# Altium schematic sheet I2S_DAC.SchDoc
size A4
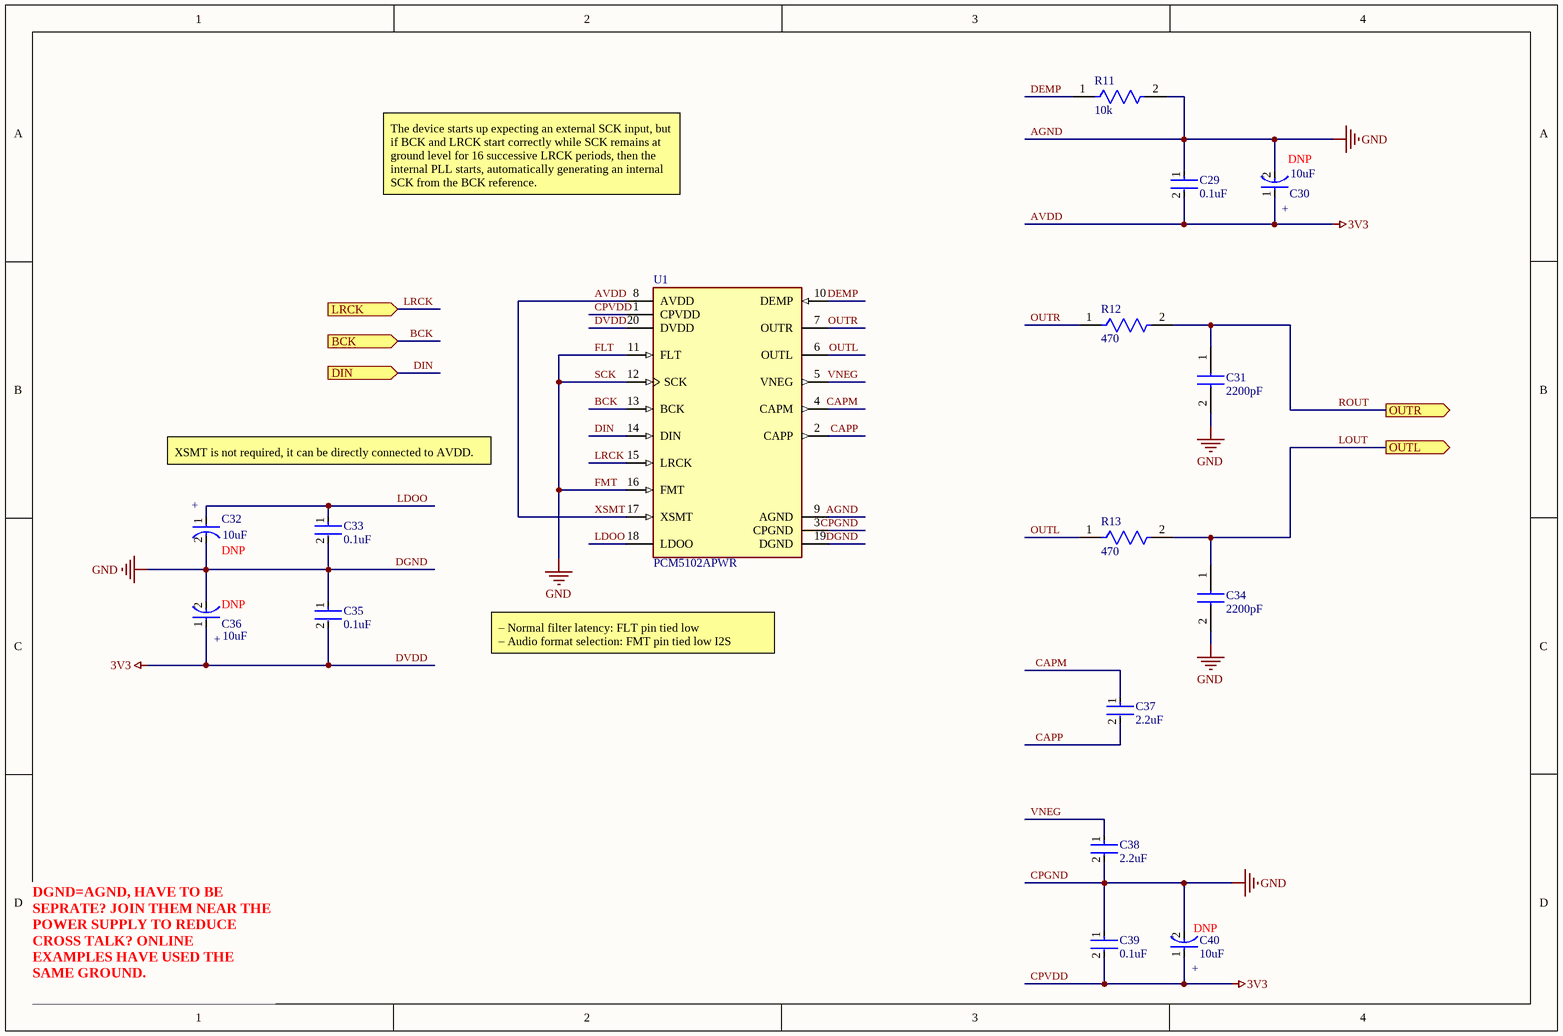
[diagram p0: I2S_DAC.SchDoc]

## Parts
C29  0.1uF  [TDK_C2012-125-0_2_IPC_A]
C30  10uF  Load: DNP  [Panasonic_EEE-1CA100SR_0]
C31  2200pF  [CAPC1608X90N]
C32  10uF  Load: DNP  [Panasonic_EEE-1CA100SR_0]
C33  0.1uF  [TDK_C2012-125-0_2_IPC_A]
C34  2200pF  [CAPC1608X90N]
C35  0.1uF  [TDK_C2012-125-0_2_IPC_A]
C36  10uF  Load: DNP  [Panasonic_EEE-1CA100SR_0]
C37  2.2uF  [Samsung_CL21_IPC_A]
C38  2.2uF  [Samsung_CL21_IPC_A]
C39  0.1uF  [TDK_C2012-125-0_2_IPC_A]
C40  10uF  Load: DNP  [Panasonic_EEE-1CA100SR_0]
R11  10k  [Stackpole_Electronics_RMCF0603_IPC_A]
R12  470  [Stackpole_Electronics_RMCF0603_IPC_A]
R13  470  [Stackpole_Electronics_RMCF0603_IPC_A]
U1  PCM5102APWR  [Texas_Instruments_PW0020A_IPC_A]

## Ports
BCK (in), DIN (in), LRCK (in), OUTL (out), OUTR (out)

## Nets
AGND: C29.1 C30.2(C) C31.2 C32.2(C) C33.2 C34.2 C35.1 C36.2(C) C38.2 C39.1 C40.2(C) R11.2 U1.3(CPGND) U1.9(AGND) U1.11(FLT) U1.12(SCK) U1.16(FMT) U1.19(DGND)  [also labelled CPGND, DGND, FLT, FMT, GND, SCK]
AVDD: C29.2 C30.1(A) C35.2 C36.1(A) C39.2 C40.1(A) U1.1(CPVDD) U1.8(AVDD) U1.17(XSMT) U1.20(DVDD)  [also labelled 3V3, CPVDD, DVDD, XSMT]
BCK: U1.13(BCK) ; port BCK
CAPM: C37.1 U1.4(CAPM)
CAPP: C37.2 U1.2(CAPP)
DEMP: R11.1 U1.10(DEMP)
DIN: U1.14(DIN) ; port DIN
LDOO: C32.1(A) C33.1 U1.18(LDOO)
LOUT: C34.1 R13.2 ; port OUTL
LRCK: U1.15(LRCK) ; port LRCK
OUTL: R13.1 U1.6(OUTL)
OUTR: R12.1 U1.7(OUTR)
ROUT: C31.1 R12.2 ; port OUTR
VNEG: C38.1 U1.5(VNEG)

## Notes on the sheet
- The device starts up expecting an external SCK input, but if BCK and LRCK start correctly while SCK remains at
  ground level for 16 successive LRCK periods, then the internal PLL starts, automatically generating an internal
  SCK from the BCK reference.
- XSMT is not required, it can be directly connected to AVDD.
- – Normal filter latency: FLT pin tied low
  – Audio format selection: FMT pin tied low I2S
- DGND=AGND, HAVE TO BE SEPRATE? JOIN THEM NEAR THE POWER SUPPLY TO REDUCE CROSS TALK? ONLINE EXAMPLES HAVE USED THE SAME GROUND.
- (in symbol EEE-FC1C100R) +

## Library data of the parts
C29 C33 C35 C39 = C2012X7R2A104K125AA: C Series 0805 0.1 uF 100 V ±10 % Tolerance X7R SMT Multilayer Ceramic Capacitor; Manufacturer: TDK; Capacitance: 100nF; Tolerance: 10%; Voltage Rating: 100V; Supplier 1: Digi-Key; Manufacturer Part Number: C2012X7R2A104K; RoHS: Yes; Category: Ceramic Capacitors; Stock 1: 559939; Pricing 1: 1=0.19000, 10=0.12900, 50=0.07760, 100=0.06560, 500=0.04484, 1000=0.03968 (USD); Mount: Surface Mount; Case/Package: 0805; Number of Pins: 2; Case Code (Imperial): 0805; Case Code (Metric): 2012; Min Operating Temperature: -55°C; Max Operating Temperature: 125°C; Packaging: Tape and Reel; Package Quantity: 2000; Dielectric: X7R; Termination: SMD/SMT; Construction: Flat; Length: 2mm; Depth: 1.25mm; Radiation Hardening: No; REACH SVHC: No SVHC; ComponentLink1URL: https://datasheet.ciiva.com/3777/351print-detail-pdf-phplangenpart-noc2012x7r2a104k125aaimp-unit-xmhz-3777221.pdf?src-supplier=Arrow+Electronics; ComponentLink1Description: https://datasheet.ciiva.com/3777/351print-detail-pdf-phplangenpart-noc2012x7r2a104k125aaimp-unit-xmhz-3777221.pdf?src-supplier=Arrow+Electronics; ComponentLink2URL: https://datasheet.ciiva.com/15192/getdatasheetpartid-149415-15192179.pdf?src-supplier=Verical; ComponentLink2Description: https://datasheet.ciiva.com/15192/getdatasheetpartid-149415-15192179.pdf?src-supplier=Verical; ComponentLink3URL: https://datasheet.ciiva.com/15918/517print-detail-pdf-phplangenpart-noc2012x7r2a104k125aaimp-unit-xmhz-15918629.pdf?src-supplier=Onlinecomponents.com; ComponentLink3Description: https://datasheet.ciiva.com/15918/517print-detail-pdf-phplangenpart-noc2012x7r2a104k125aaimp-unit-xmhz-15918629.pdf?src-supplier=Onlinecomponents.com; Supplier Part Number 1: 445-1418-1-ND
C30 C32 C36 C40 = EEE-FC1C100R: Cap Aluminum 10uF 16V 20% (4 X 5.4mm) SMD 60mA 1000 hr 105C T/R; Part Number: EEE-1CA100SR; Manufacturer: Panasonic; Value: 10.0µF; Material: Aluminium; Ripple Current (AC): 50mA; Impedance: 3R; Life (Hours): 1000Hour; Leakage Current: 3uA; Lead Length: 1.8mm; helpURL: https://upverter.com/upn/revision/35123ac30fb7e617/; Temperature: -40°C to +85°C; Package: CAP_SMT_4MM3_4MM3; Supplier 2: Mouser; Price: 0.105580265411; Supplier 1: Digi-Key; Supplier Part Number 2: 667-EEE-1CA100SR; Supplier Part Number 1: PCE3878CT-ND; RoHS: TRUE; Mouser Part Number: 667-EEE-1CA100SR; Tolerance: ±20%; Temperature Range High: +85°C; Digikey Description: CAP 10µF 16V Aluminum Capacitors Radial, Can - SMD 2000 Hrs @ 85°C; Digikey Part Number: PCE3878CT-ND; Lead Free: yes; Temperature Range Low: -40°C; Mounting Type: Surface Mount; Capacitance: 10.0µF; Voltage: 16V; Supplier 3: Digi-Key; Manufacturer Part Number: EEE-FC1C100R; Category: Aluminum Electrolytic Capacitors; Stock 3: 93767; Pricing 3: 1=0.33000, 10=0.23100, 50=0.16180, 100=0.13870, 500=0.10402, 1000=0.08784 (USD); Mount: Surface Mount,PCB; Case/Package: Radial; Number of Pins: 2; Contact Plating: Tin; Dielectric Material: Aluminium; Min Operating Temperature: -40°C; Max Operating Temperature: 105°C; Voltage Rating: 16V; Packaging: Tape and Reel; Voltage Rating (DC): 16V; ESR (Equivalent Series Resistance): 3R; Ripple Current: 60mA; Package Quantity: 1; Termination: SMD/SMT; Series: FC; Construction: Cylindrical; Diameter: 4mm; Length: 5.5mm; Width: 4.3mm; Height: 5.4mm; Height - Seated (Max): 0.213inch; Lead Pitch: 1mm; Radiation Hardening: No; REACH SVHC: No SVHC; RoHS Compliant: Yes; ComponentLink1URL: https://datasheet.ciiva.com/11779/0900766b806bc525-11779699.pdf?src-supplier=RSComponents; ComponentLink1Description: https://datasheet.ciiva.com/11779/0900766b806bc525-11779699.pdf?src-supplier=RSComponents; ComponentLink2URL: https://datasheet.ciiva.com/29313/443516-da-01-en-smd-elko-vfc-b-10-uf-16v-29313714.pdf?src-supplier=Conrad; ComponentLink2Description: https://datasheet.ciiva.com/29313/443516-da-01-en-smd-elko-vfc-b-10-uf-16v-29313714.pdf?src-supplier=Conrad; ComponentLink3URL: https://datasheet.ciiva.com/2985/aba0000ce5-2985278.pdf?src-supplier=Avnet; ComponentLink3Description: https://datasheet.ciiva.com/2985/aba0000ce5-2985278.pdf?src-supplier=Avnet; ComponentLink4URL: https://datasheet.ciiva.com/2985/aba0000ce5-2985279.pdf?src-supplier=Avnet; ComponentLink4Description: https://datasheet.ciiva.com/2985/aba0000ce5-2985279.pdf?src-supplier=Avnet; ComponentLink5URL: https://datasheet.ciiva.com/28694/31718-28694775.pdf?src-supplier=Element14; ComponentLink5Description: https://datasheet.ciiva.com/28694/31718-28694775.pdf?src-supplier=Element14; ComponentLink6URL: https://datasheet.ciiva.com/46388/31718-46388204.pdf?src-supplier=Element14; ComponentLink6Description: https://datasheet.ciiva.com/46388/31718-46388204.pdf?src-supplier=Element14; ComponentLink7URL: https://datasheet.ciiva.com/16508/aba0000ce5-16508393.pdf?src-supplier=Future+Electronics; ComponentLink7Description: https://datasheet.ciiva.com/16508/aba0000ce5-16508393.pdf?src-supplier=Future+Electronics; ComponentLink8URL: https://datasheet.ciiva.com/17353/aba0000ce5-17353355.pdf?src-supplier=Avnet+Europe; ComponentLink8Description: https://datasheet.ciiva.com/17353/aba0000ce5-17353355.pdf?src-supplier=Avnet+Europe; ComponentLink9URL: https://datasheet.ciiva.com/48542/eeefc-series-eng-tds-48542826.pdf?src-supplier=Distrelec; ComponentLink9Description: https://datasheet.ciiva.com/48542/eeefc-series-eng-tds-48542826.pdf?src-supplier=Distrelec; Supplier Part Number 3: PCE3995CT-ND
C31 C34 = 06035C222KAT2A: CAP CER 2200PF 50V X7R 0603; Manufacturer: Kyocera AVX; Dielectric Material: Ceramic; Capacitance: 2.2nF; Tolerance: 10%; Voltage: 25V; Dissipation Factor: 2.5%; Supplier 1: Digi-Key; Manufacturer Part Number: 06035C222KAT2A; RoHS: Yes; Category: Ceramic Capacitors; Stock 1: 123694; Pricing 1: 1=0.10000, 10=0.07000, 50=0.03800, 100=0.03100, 500=0.02214, 1000=0.01739 (USD); Mount: Surface Mount; Case/Package: 0603; Number of Pins: 2; Case Code (Metric): 1608; Case Code (Imperial): 0603; Contact Plating: Tin,Matte; Min Operating Temperature: -55°C; Max Operating Temperature: 125°C; Voltage Rating (DC): 50V; Packaging: Tape and Reel; Dielectric: X7R; Voltage Rating: 50V; Package Quantity: 1; Termination: SMD/SMT; Series: -; Construction: Flat; Length: 1.6mm; Width: 0.032inch; Height: 0.9mm; Depth: 0.81mm; Thickness: 0.035inch; Radiation Hardening: No; REACH SVHC: No SVHC; Lead Free: Lead Free; RoHS Compliant: Yes; ComponentLink1URL: https://datasheet.ciiva.com/11788/0900766b802d4698-11788065.pdf?src-supplier=RSComponents; ComponentLink1Description: https://datasheet.ciiva.com/11788/0900766b802d4698-11788065.pdf?src-supplier=RSComponents; ComponentLink2URL: https://datasheet.ciiva.com/160/cx7r-160968.pdf?src-supplier=Digi-Key; ComponentLink2Description: https://datasheet.ciiva.com/160/cx7r-160968.pdf?src-supplier=Digi-Key; ComponentLink3URL: https://datasheet.ciiva.com/160/cx7r-160969.pdf?src-supplier=Digi-Key; ComponentLink3Description: https://datasheet.ciiva.com/160/cx7r-160969.pdf?src-supplier=Digi-Key; ComponentLink4URL: https://datasheet.ciiva.com/160/cx7r-160970.pdf?src-supplier=Digi-Key; ComponentLink4Description: https://datasheet.ciiva.com/160/cx7r-160970.pdf?src-supplier=Digi-Key; ComponentLink5URL: https://datasheet.ciiva.com/5415/cx7r-218113-5415163.pdf?src-supplier=Mouser; ComponentLink5Description: https://datasheet.ciiva.com/5415/cx7r-218113-5415163.pdf?src-supplier=Mouser; ComponentLink6URL: https://datasheet.ciiva.com/2987/cx7r-2987841.pdf?src-supplier=Avnet; ComponentLink6Description: https://datasheet.ciiva.com/2987/cx7r-2987841.pdf?src-supplier=Avnet; ComponentLink7URL: https://datasheet.ciiva.com/28546/cx7r-28546597.pdf?src-supplier=Element14; ComponentLink7Description: https://datasheet.ciiva.com/28546/cx7r-28546597.pdf?src-supplier=Element14; ComponentLink8URL: https://datasheet.ciiva.com/1457/1679506-1457930.pdf?src-supplier=Element14; ComponentLink8Description: https://datasheet.ciiva.com/1457/1679506-1457930.pdf?src-supplier=Element14; ComponentLink9URL: https://datasheet.ciiva.com/1457/1679506-1457931.pdf?src-supplier=Element14; ComponentLink9Description: https://datasheet.ciiva.com/1457/1679506-1457931.pdf?src-supplier=Element14; Supplier Part Number 1: 478-1219-1-ND
C37 C38 = CL21B225KAFNFNE: CAP CER 2.2UF 25V X7R 0805; Manufacturer: Samsung; Tolerance: 10%; Supplier 1: Digi-Key; Manufacturer Part Number: CL21B225KAFNFNE; RoHS: Yes; Category: Ceramic Capacitors; Stock 1: 369523; Pricing 1: 1=0.22000, 10=0.15700, 50=0.08920, 100=0.07390, 500=0.05180, 1000=0.04289 (USD); Mount: Surface Mount; Case/Package: 0805; Case Code (Metric): 2012; Case Code (Imperial): 0805; Min Operating Temperature: -55°C; Max Operating Temperature: 125°C; Package Quantity: 1; Packaging: Tape and Reel; Capacitance: 2.2uF; Voltage Rating: 25V; Dielectric: X7R; Series: CL; Construction: Flat; Length: 0.079inch; Width: 0.049inch; Height: 1.25mm; Thickness: 0.053inch; Depth: 1.25mm; Radiation Hardening: No; Lead Free: Lead Free; RoHS Compliant: Yes; ComponentLink1URL: https://datasheet.ciiva.com/25798/cl21b225kafnfne-25798721.pdf?src-supplier=Digi-Key; ComponentLink1Description: https://datasheet.ciiva.com/25798/cl21b225kafnfne-25798721.pdf?src-supplier=Digi-Key; Supplier Part Number 1: 1276-2953-1-ND
R11 = RMCF0603JT10K0: Res Thick Film 0603 10K Ohm 5% 1/10W ±100ppm/°C Molded SMD SMD Paper T/R; Manufacturer: Stackpole Electronics; Power Rating: 100mW; Resistance: 10kR; Supplier 1: Digi-Key; Manufacturer Part Number: RMCF0603JT10K0; RoHS: Yes; Category: Chip SMD Resistors; Stock 1: 737230; Pricing 1: 1=0.10000, 10=0.01500, 100=0.00610, 1000=0.00274, 2500=0.00238 (USD); Mount: Surface Mount; Case/Package: 0603; Case Code (Metric): 1608; Case Code (Imperial): 0603; Contact Plating: Tin,Matte; Size Code: 0603; Min Operating Temperature: -55°C; Max Operating Temperature: 155°C; Tolerance: 5%; Packaging: Tape and Reel; Resistor Type: Thick Film; Number of Terminations: 2; Max Power Dissipation: 100mW; Temperature Coefficient: 100ppm/°C; Features: Automotive AEC-Q200; Series: RMCF; Construction: Rectangular; Length: 1.55mm; Width: 0.031inch; Height: 0.022inch; Depth: 0.8mm; Radiation Hardening: No; Military Standard: Not; Lead Free: Lead Free; ComponentLink1URL: https://datasheet.ciiva.com/15193/getdatasheetpartid-364254-15193501.pdf?src-supplier=Verical; ComponentLink1Description: https://datasheet.ciiva.com/15193/getdatasheetpartid-364254-15193501.pdf?src-supplier=Verical; Supplier Part Number 1: RMCF0603JT10K0CT-ND
R12 R13 = RMCF0603JT470R: Res Thick Film 0603 470 Ohm 5% 0.1W(1/10W) ±200ppm/C Molded SMD Automotive T/R; Manufacturer: Stackpole Electronics; Resistance: 470R; Power Rating: 100mW; Temperature Coefficient: 100ppm/°C; Working Voltage: 75V; Supplier 1: Digi-Key; Manufacturer Part Number: RMCF0603JT470R; RoHS: Yes; Category: Chip SMD Resistors; Stock 1: 206871; Pricing 1: 1=0.10000, 10=0.01500, 100=0.00610, 1000=0.00274, 2500=0.00238 (USD); Mount: Surface Mount; Case/Package: 0603; Case Code (Metric): 1608; Case Code (Imperial): 0603; Contact Plating: Tin,Matte; Min Operating Temperature: -55°C; Max Operating Temperature: 155°C; Packaging: Tape and Reel; Tolerance: 5%; Package Quantity: 1; Resistor Type: Thick Film; Number of Terminations: 2; Max Power Dissipation: 100mW; Features: Automotive AEC-Q200; Series: RMCF; Technology: THICK FILM; Construction: Rectangular; Length: 1.55mm; Width: 0.031inch; Height: 0.022inch; Depth: 0.8mm; Radiation Hardening: No; Military Standard: Not; Lead Free: Lead Free; RoHS Compliant: Yes; ComponentLink1URL: https://datasheet.ciiva.com/15193/getdatasheetpartid-360691-15193516.pdf?src-supplier=Verical; ComponentLink1Description: https://datasheet.ciiva.com/15193/getdatasheetpartid-360691-15193516.pdf?src-supplier=Verical; Supplier 2: Digi-Key; Stock 2: 206871; Pricing 2: 1=0.10000, 10=0.01500, 100=0.00610, 1000=0.00274, 2500=0.00238 (USD); Supplier 3: Arrow Electronics; Stock 3: 1772197; Pricing 3: 5000=0.00470, 10000=0.00330, 25000=0.00190, 1=0.04130, 10=0.04100, 25=0.04080, 100=0.01620, 250=0.00920, 500=0.00520, 1000=0.00470 (USD); Supplier Part Number 1: RMCF0603JT470RCT-ND; Supplier Part Number 2: RMCF0603JT470RDKR-ND; Supplier Part Number 3: RMCF0603JT470R
U1 = PCM5102APWR: DAC 2-CH Segment 32-bit 20-Pin TSSOP T/R; Manufacturer: Texas Instruments; Number of DAC Channels: 2; Max Power Dissipation: 187mW; Interface: Serial,I2S; Resolution: 32b; Sampling Rate: 384KS/s; Signal to Noise Ratio (SNR): 112dB; Supply Type: Analog,Digital; Number of Bits: 32; Power Consumption: 59.4mW; Polarity: Unipolar; Max Supply Voltage: 3.6V; Operating Supply Voltage: 3.3V; Min Supply Voltage: 3V; Number of Analog Inputs: 0; Output Type: Voltage; Supplier 1: Digi-Key; Supplier 2: Mouser; Supplier 3: Digi-Key; Supplier 4: Digi-Key; Supplier 5: Arrow Electronics; Supplier Part Number 1: 296-36707-1-ND; Supplier Part Number 2: 595-PCM5102APWR; Supplier Part Number 3: 296-36707-6-ND; Supplier Part Number 4: 296-36707-2-ND; Supplier Part Number 5: PCM5102APWR; Manufacturer Part Number: PCM5102APWR; RoHS: Yes; Category: Digital to Analog Converters (DACs); Pricing 1: 1=5.03000, 10=4.51300, 25=4.26680, 100=3.69790, 250=3.50824, 500=3.14792, 1000=2.98763 (USD); Mount: Surface Mount; Case/Package: TSSOP; Number of Pins: 20; Contact Plating: Gold; Min Operating Temperature: -25°C; Max Operating Temperature: 85°C; Package Quantity: 2000; Packaging: Tape and Reel; Number of Converters: 2; Conversion Rate: 384KS/s; Number of Analog Outputs: 2; Series: DirectPath™; REACH SVHC: No SVHC; Lead Free: Lead Free; ComponentLink1URL: https://datasheet.ciiva.com/24021/slas859a-261040-24021907.pdf?src-supplier=Mouser; ComponentLink1Description: https://datasheet.ciiva.com/24021/slas859a-261040-24021907.pdf?src-supplier=Mouser; ComponentLink2URL: https://datasheet.ciiva.com/29648/pcm5102a-29648362.pdf?src-supplier=Digi-Key; ComponentLink2Description: https://datasheet.ciiva.com/29648/pcm5102a-29648362.pdf?src-supplier=Digi-Key; ComponentLink3URL: https://datasheet.ciiva.com/6673/pcm5102a-6673611.pdf?src-supplier=Digi-Key; ComponentLink3Description: https://datasheet.ciiva.com/6673/pcm5102a-6673611.pdf?src-supplier=Digi-Key